# EAGLE design driver (EAGLE 9.0.1)
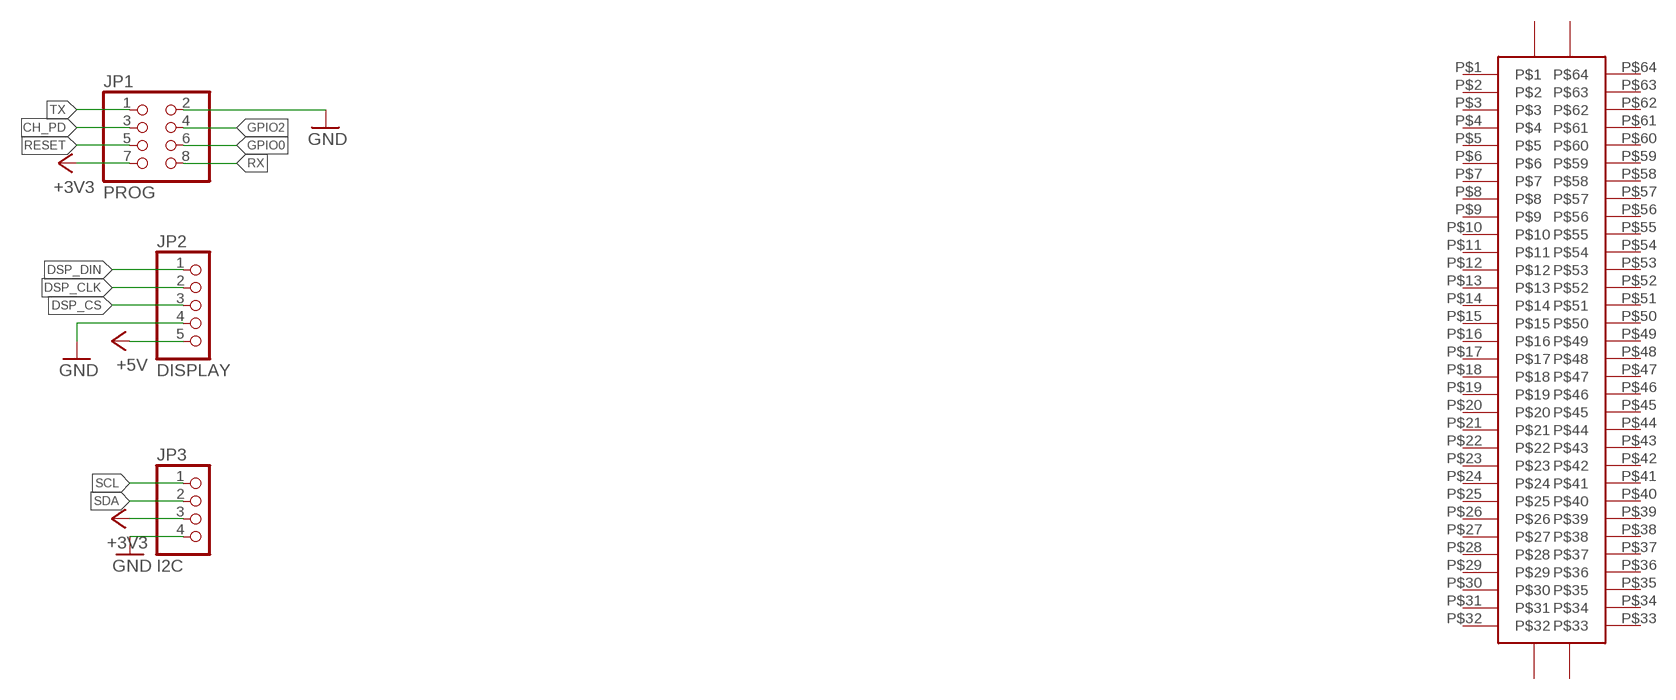
[diagram p0: schematic, sheet 1]

## Parts
JP1  PROG  PINHD-2X4  [2X04]
JP2  DISPLAY  PINHD-1X5  [1X05]
JP3  I2C  PINHD-1X4  [1X04]
U$1  ANGLE_BOARD_CONNECTORTWO_SIDED  [TWO_SIDED]

## Nets
+3V3 [power]: JP1.7 JP3.3
+5V [power]: JP2.5
CH_PD: JP1.3
DSP_CLK: JP2.2
DSP_CS: JP2.3
DSP_DIN: JP2.1
GND [gnd]: JP1.2 JP2.4 JP3.4
GPIO0: JP1.6
GPIO2: JP1.4
RESET: JP1.5
RX: JP1.8
SCL: JP3.1
SDA: JP3.2
TX: JP1.1
Unconnected: U$1.GND@1(GND) U$1.GND@2(GND) U$1.GND@3(GND) U$1.GND@4(GND) U$1.P$1 U$1.P$2 U$1.P$3 U$1.P$4 U$1.P$5 U$1.P$6 U$1.P$7 U$1.P$8 U$1.P$9 U$1.P$10 U$1.P$11 U$1.P$12 U$1.P$13 U$1.P$14 U$1.P$15 U$1.P$16 U$1.P$17 U$1.P$18 U$1.P$19 U$1.P$20 U$1.P$21 U$1.P$22 U$1.P$23 U$1.P$24 U$1.P$25 U$1.P$26 U$1.P$27 U$1.P$28 U$1.P$29 U$1.P$30 U$1.P$31 U$1.P$32 U$1.P$33 U$1.P$34 U$1.P$35 U$1.P$36 U$1.P$37 U$1.P$38 U$1.P$39 U$1.P$40 U$1.P$41 U$1.P$42 U$1.P$43 U$1.P$44 U$1.P$45 U$1.P$46 U$1.P$47 U$1.P$48 U$1.P$49 U$1.P$50 U$1.P$51 U$1.P$52 U$1.P$53 U$1.P$54 U$1.P$55 U$1.P$56 U$1.P$57 U$1.P$58 U$1.P$59 U$1.P$60 U$1.P$61 U$1.P$62 U$1.P$63 U$1.P$64

## Library data of the parts
JP1 = pinhead:PINHD-2X4: PIN HEADER
JP2 = pinhead:PINHD-1X5: PIN HEADER
JP3 = pinhead:PINHD-1X4: PIN HEADER
U$1 = interboard:ANGLE_BOARD_CONNECTOR: Angle interboard connector

## Net classes
0 default: width 0.3 mm
1 power: width 0.5 mm
2 gnd: width 0.5 mm

## Board
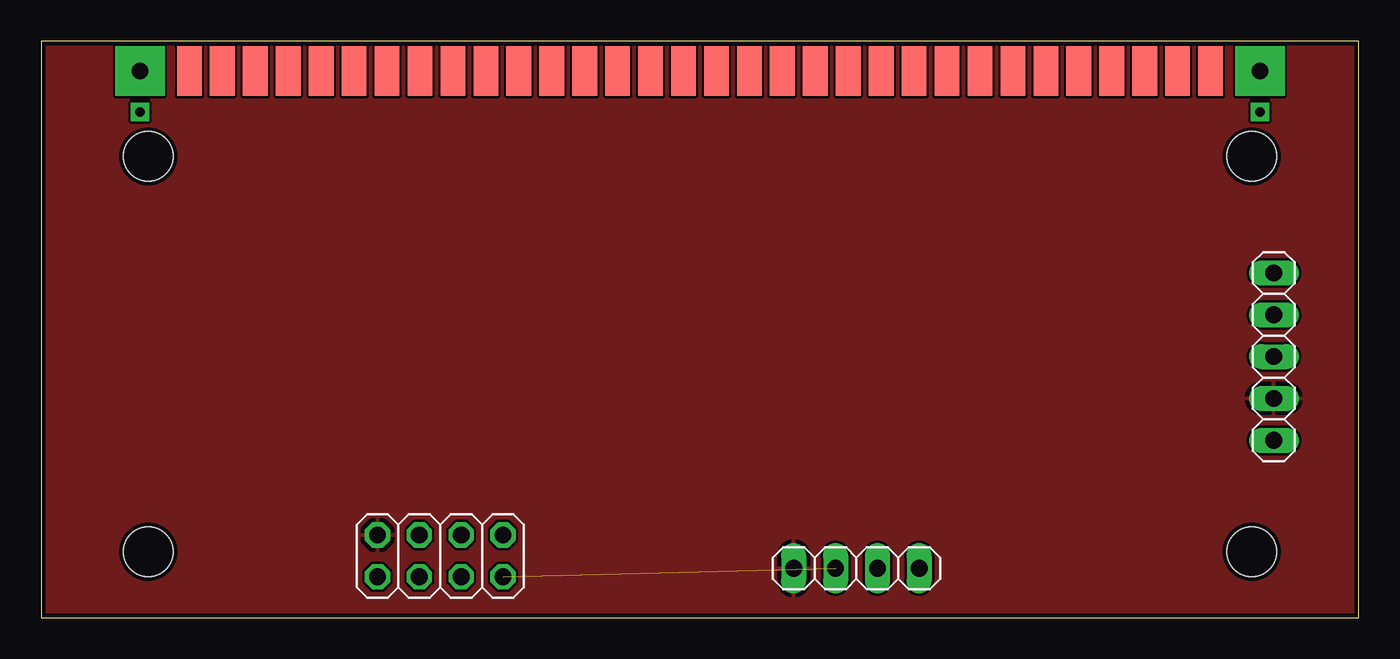
[diagram p1: board, top side]
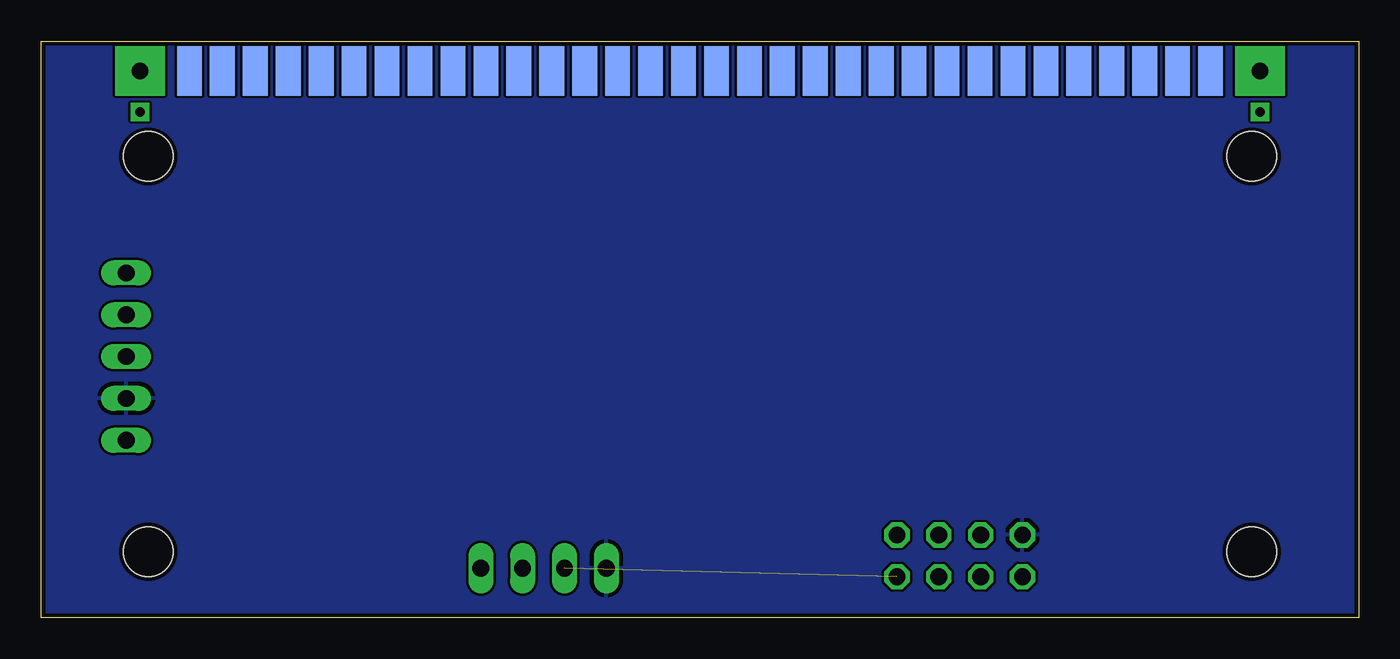
[diagram p2: board, bottom side, seen from below]

Size 80 x 35 mm. Coordinates in mm from the lower left corner, seen from the top.
Outline: 0,0 80,0 80,35 0,35 0,0
Copper layers (1*16): Top 0.035mm / dielectric 1.5mm / Bottom 0.035mm
Design rules "SeeedStudio_2layer_DRU_no_angle_20140221": minimum track width 6mil, minimum drill 12mil, track to track 6mil, track to pad 6mil, pad to pad 6mil, via to via 6mil, smd to smd 0mil, copper to edge 10mil, drill to drill 10mil, minimum pad ring 10mil, minimum via ring 6mil, stop-mask expansion 2mil, vias tented up to drill 100mil, thermal gap 10mil
Holes 3 mm at 6.5,4 6.5,28 73.5,4 73.5,28

### Footprints (pad centres in the part's own frame; a part is rotated, then mirrored left to right if it is on the bottom)
2X04 = drill 1.016 octagon: 1 -3.81,-1.27; 2 -3.81,1.27; 3 -1.27,-1.27; 4 -1.27,1.27; 5 1.27,-1.27; 6 1.27,1.27; 7 3.81,-1.27; 8 3.81,1.27
1X05 = drill 1.016 long: 1 -5.08,0; 2 -2.54,0; 3 0,0; 4 2.54,0; 5 5.08,0
1X04 = drill 1.016 long: 1 -3.81,0; 2 -1.27,0; 3 1.27,0; 4 3.81,0
TWO_SIDED = drill 1 pad 3 square: GND@1 1.5,1.5; GND@2 69.5,1.5 | drill 0.6 square: GND@3 1.5,4; GND@4 69.5,4 | smd 1.5 x 3: P$1 4.5,1.5; P$2 6.5,1.5; P$3 8.5,1.5; P$4 10.5,1.5; P$5 12.5,1.5; P$6 14.5,1.5; P$7 16.5,1.5; P$8 18.5,1.5; P$9 20.5,1.5; P$10 22.5,1.5; P$11 24.5,1.5; P$12 26.5,1.5; P$13 28.5,1.5; P$14 30.5,1.5; P$15 32.5,1.5; P$16 34.5,1.5; P$17 36.5,1.5; P$18 38.5,1.5; P$19 40.5,1.5; P$20 42.5,1.5; P$21 44.5,1.5; P$22 46.5,1.5; P$23 48.5,1.5; P$24 50.5,1.5; P$25 52.5,1.5; P$26 54.5,1.5; P$27 56.5,1.5; P$28 58.5,1.5; P$29 60.5,1.5; P$30 62.5,1.5; P$31 64.5,1.5; P$32 66.5,1.5 | smd 1.5 x 3 bottom: P$33 66.5,1.5; P$34 64.5,1.5; P$35 62.5,1.5; P$36 60.5,1.5; P$37 58.5,1.5; P$38 56.5,1.5; P$39 54.5,1.5; P$40 52.5,1.5; P$41 50.5,1.5; P$42 48.5,1.5; P$43 46.5,1.5; P$44 44.5,1.5; P$45 42.5,1.5; P$46 40.5,1.5; P$47 38.5,1.5; P$48 36.5,1.5; P$49 34.5,1.5; P$50 32.5,1.5; P$51 30.5,1.5; P$52 28.5,1.5; P$53 26.5,1.5; P$54 24.5,1.5; P$55 22.5,1.5; P$56 20.5,1.5; P$57 18.5,1.5; P$58 16.5,1.5; P$59 14.5,1.5; P$60 12.5,1.5; P$61 10.5,1.5; P$62 8.5,1.5; P$63 6.5,1.5; P$64 4.5,1.5

### Placement (x,y rotation side)
JP1  24.23,3.75 0 top
JP2  74.84,15.85 270 top
JP3  49.5,3 180 top
U$1  75.5,34.7 180 top

### Tracks (layer width: path | path; a pad name or v marks a point on that pad's centre or on a via)
+3V3  (1 unrouted)
GND
  pour Bottom: 0,0 80,0 80,35 0,35
  pour Top: 0,0 80,0 80,35 0,35